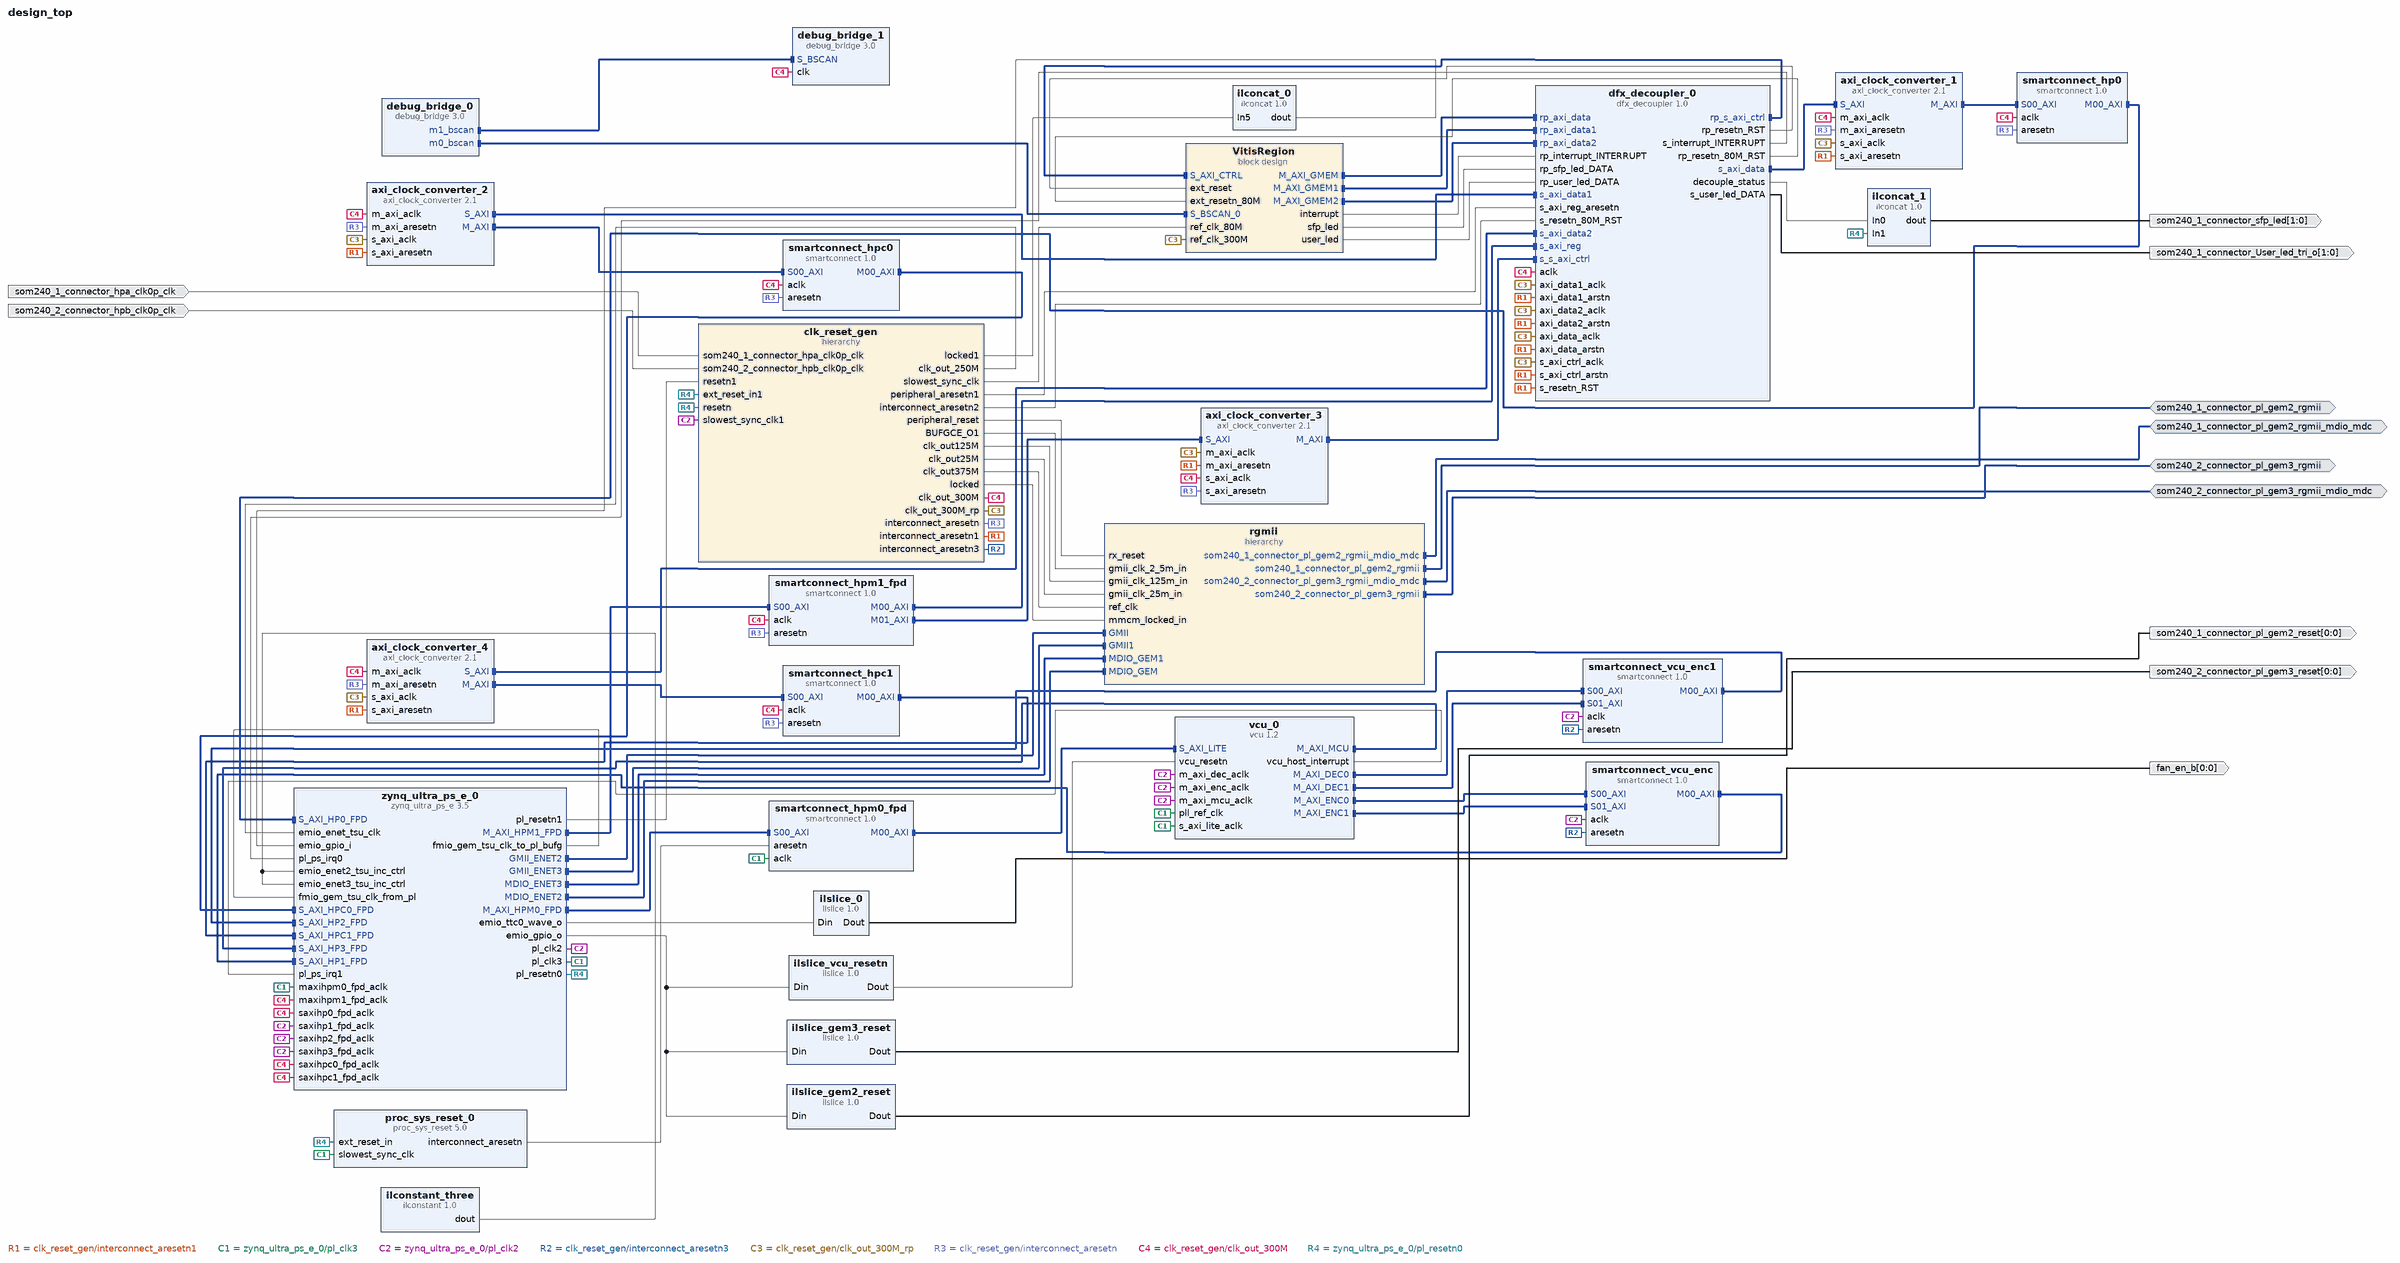
[diagram p0: block diagram of the top level]
# Vivado block design design_top, xck26-sfvc784-2LV-c, Vivado 2025.2
create_bd_design design_top

create_bd_intf_port -mode Master -vlnv xilinx.com:interface:mdio_rtl:1.0 som240_1_connector_pl_gem2_rgmii_mdio_mdc
create_bd_intf_port -mode Master -vlnv xilinx.com:interface:rgmii_rtl:1.0 som240_1_connector_pl_gem2_rgmii
create_bd_intf_port -mode Master -vlnv xilinx.com:interface:mdio_rtl:1.0 som240_2_connector_pl_gem3_rgmii_mdio_mdc
create_bd_intf_port -mode Master -vlnv xilinx.com:interface:rgmii_rtl:1.0 som240_2_connector_pl_gem3_rgmii
create_bd_port -dir I -type clk som240_2_connector_hpb_clk0p_clk
set_property -dict {CONFIG.FREQ_HZ 25000000 CONFIG.PHASE 0.0} [get_bd_ports som240_2_connector_hpb_clk0p_clk]
create_bd_port -dir I -type clk som240_1_connector_hpa_clk0p_clk
set_property -dict {CONFIG.FREQ_HZ 25000000 CONFIG.PHASE 0.0} [get_bd_ports som240_1_connector_hpa_clk0p_clk]
create_bd_port -dir O -from 0 -to 0 fan_en_b
create_bd_port -dir O -from 0 -to 0 -type rst som240_1_connector_pl_gem2_reset
create_bd_port -dir O -from 0 -to 0 -type rst som240_2_connector_pl_gem3_reset
create_bd_port -dir O -from 1 -to 0 som240_1_connector_User_led_tri_o
create_bd_port -dir O -from 1 -to 0 -type data som240_1_connector_sfp_led

create_bd_cell -type inline_hdl -vlnv xilinx.com:inline_hdl:ilslice:1.0 ilslice_0
set_property -dict {CONFIG.DIN_FROM 2 CONFIG.DIN_TO 2 CONFIG.DIN_WIDTH 3} [get_bd_cells ilslice_0]
create_bd_cell -type hier rgmii
create_bd_cell -type ip -vlnv xilinx.com:ip:dfx_decoupler:1.0 dfx_decoupler_0
set_property -dict [list \
  CONFIG.ALL_PARAMS {['ALWAYS_HAVE_AXI_CLK 1', 'INTF {', 'axi_data {ID 0 VLNV xilinx.com:interface:aximm_rtl:1.0 PROTOCOL AXI4 SIGNALS {ARVALID {WIDTH 1 PRESENT 1} ARREADY {WIDTH 1 PRESENT 1} AWVALID {WIDTH 1 PRESENT 1} AWREADY {WIDTH 1 PRESENT 1} BVALID', '{WIDTH 1 PRESENT 1} BREADY {WIDTH 1 PRESENT 1} RVALID {WIDTH 1 PRESENT 1} RREADY {WIDTH 1 PRESENT 1} WVALID {WIDTH 1 PRESENT 1} WREADY {WIDTH 1 PRESENT 1} AWID {WIDTH 0 PRESENT 0} AWADDR {WIDTH 36', 'PRESENT 1} AWLEN {WIDTH 8 PRESENT 1} AWSIZE {WIDTH 3 PRESENT 1} AWBURST {WIDTH 2 PRESENT 0} AWLOCK {WIDTH 1 PRESENT 0} AWCACHE {WIDTH 4 PRESENT 1} AWPROT {WIDTH 3 PRESENT 1} AWREGION {WIDTH 4 PRESENT', '0} AWQOS {WIDTH 4 PRESENT 0} AWUSER {WIDTH 0 PRESENT 0} WID {WIDTH 0 PRESENT 0} WDATA {WIDTH 32 PRESENT 1} WSTRB {WIDTH 4 PRESENT 1} WLAST {WIDTH 1 PRESENT 1} WUSER {WIDTH 0 PRESENT 0} BID {WIDTH 0', 'PRESENT 0} BRESP {WIDTH 2 PRESENT 1} BUSER {WIDTH 0 PRESENT 0} ARID {WIDTH 0 PRESENT 0} ARADDR {WIDTH 36 PRESENT 1} ARLEN {WIDTH 8 PRESENT 1} ARSIZE {WIDTH 3 PRESENT 1} ARBURST {WIDTH 2 PRESENT 0}', 'ARLOCK {WIDTH 1 PRESENT 0} ARCACHE {WIDTH 4 PRESENT 1} ARPROT {WIDTH 3 PRESENT 1} ARREGION {WIDTH 4 PRESENT 0} ARQOS {WIDTH 4 PRESENT 0} ARUSER {WIDTH 0 PRESENT 0} RID {WIDTH 0 PRESENT 0} RDATA {WIDTH', '32 PRESENT 1} RRESP {WIDTH 2 PRESENT 0} RLAST {WIDTH 1 PRESENT 1} RUSER {WIDTH 0 PRESENT 0}}} resetn {ID 1 VLNV xilinx.com:signal:reset_rtl:1.0 MODE slave SIGNALS {RST {PRESENT 1 WIDTH 1}}} resetn_80M', '{ID 3 VLNV xilinx.com:signal:reset_rtl:1.0 MODE slave SIGNALS {RST {PRESENT 1 WIDTH 1}}} sfp_led {ID 4 VLNV xilinx.com:signal:data_rtl:1.0 SIGNALS {DATA {MANAGEMENT manual WIDTH 2}}} user_led {ID 5', 'MODE master VLNV xilinx.com:signal:data_rtl:1.0 SIGNALS {DATA {MANAGEMENT manual WIDTH 2}}} interrupt {ID 2 VLNV xilinx.com:signal:interrupt_rtl:1.0 SIGNALS {INTERRUPT {MANAGEMENT manual WIDTH 8}}}', 's_axi_ctrl {ID 6 VLNV xilinx.com:interface:aximm_rtl:1.0 PROTOCOL AXI4LITE SIGNALS {ARVALID {PRESENT 1 WIDTH 1} ARREADY {PRESENT 1 WIDTH 1} AWVALID {PRESENT 1 WIDTH 1} AWREADY {PRESENT 1 WIDTH 1}', 'BVALID {PRESENT 1 WIDTH 1} BREADY {PRESENT 1 WIDTH 1} RVALID {PRESENT 1 WIDTH 1} RREADY {PRESENT 1 WIDTH 1} WVALID {PRESENT 1 WIDTH 1} WREADY {PRESENT 1 WIDTH 1} AWADDR {PRESENT 1 WIDTH 32} AWLEN', '{PRESENT 0 WIDTH 8} AWSIZE {PRESENT 0 WIDTH 3} AWBURST {PRESENT 0 WIDTH 2} AWLOCK {PRESENT 0 WIDTH 1} AWCACHE {PRESENT 0 WIDTH 4} AWPROT {PRESENT 1 WIDTH 3} WDATA {PRESENT 1 WIDTH 32} WSTRB {PRESENT 1', 'WIDTH 4} WLAST {PRESENT 0 WIDTH 1} BRESP {PRESENT 1 WIDTH 2} ARADDR {PRESENT 1 WIDTH 32} ARLEN {PRESENT 0 WIDTH 8} ARSIZE {PRESENT 0 WIDTH 3} ARBURST {PRESENT 0 WIDTH 2} ARLOCK {PRESENT 0 WIDTH 1}', 'ARCACHE {PRESENT 0 WIDTH 4} ARPROT {PRESENT 1 WIDTH 3} RDATA {PRESENT 1 WIDTH 32} RRESP {PRESENT 1 WIDTH 2} RLAST {PRESENT 0 WIDTH 1} AWID {WIDTH 0 PRESENT 0} AWREGION {WIDTH 4 PRESENT 0} AWQOS {WIDTH', '4 PRESENT 0} AWUSER {WIDTH 0 PRESENT 0} WID {WIDTH 0 PRESENT 0} WUSER {WIDTH 0 PRESENT 0} BID {WIDTH 0 PRESENT 0} BUSER {WIDTH 0 PRESENT 0} ARID {WIDTH 0 PRESENT 0} ARREGION {WIDTH 4 PRESENT 0} ARQOS', '{WIDTH 4 PRESENT 0} ARUSER {WIDTH 0 PRESENT 0} RID {WIDTH 0 PRESENT 0} RUSER {WIDTH 0 PRESENT 0}} MODE slave} axi_data1 {ID 7 VLNV xilinx.com:interface:aximm_rtl:1.0 PROTOCOL AXI4 SIGNALS {ARVALID', '{WIDTH 1 PRESENT 1} ARREADY {WIDTH 1 PRESENT 1} AWVALID {WIDTH 1 PRESENT 1} AWREADY {WIDTH 1 PRESENT 1} BVALID {WIDTH 1 PRESENT 1} BREADY {WIDTH 1 PRESENT 1} RVALID {WIDTH 1 PRESENT 1} RREADY {WIDTH 1', 'PRESENT 1} WVALID {WIDTH 1 PRESENT 1} WREADY {WIDTH 1 PRESENT 1} AWID {WIDTH 0 PRESENT 0} AWADDR {WIDTH 36 PRESENT 1} AWLEN {WIDTH 8 PRESENT 1} AWSIZE {WIDTH 3 PRESENT 1} AWBURST {WIDTH 2 PRESENT 0}', 'AWLOCK {WIDTH 1 PRESENT 0} AWCACHE {WIDTH 4 PRESENT 1} AWPROT {WIDTH 3 PRESENT 1} AWREGION {WIDTH 4 PRESENT 0} AWQOS {WIDTH 4 PRESENT 0} AWUSER {WIDTH 0 PRESENT 0} WID {WIDTH 0 PRESENT 0} WDATA {WIDTH', '32 PRESENT 1} WSTRB {WIDTH 4 PRESENT 1} WLAST {WIDTH 1 PRESENT 1} WUSER {WIDTH 0 PRESENT 0} BID {WIDTH 0 PRESENT 0} BRESP {WIDTH 2 PRESENT 1} BUSER {WIDTH 0 PRESENT 0} ARID {WIDTH 0 PRESENT 0} ARADDR', '{WIDTH 36 PRESENT 1} ARLEN {WIDTH 8 PRESENT 1} ARSIZE {WIDTH 3 PRESENT 1} ARBURST {WIDTH 2 PRESENT 0} ARLOCK {WIDTH 1 PRESENT 0} ARCACHE {WIDTH 4 PRESENT 1} ARPROT {WIDTH 3 PRESENT 1} ARREGION {WIDTH', '4 PRESENT 0} ARQOS {WIDTH 4 PRESENT 0} ARUSER {WIDTH 0 PRESENT 0} RID {WIDTH 0 PRESENT 0} RDATA {WIDTH 32 PRESENT 1} RRESP {WIDTH 2 PRESENT 0} RLAST {WIDTH 1 PRESENT 1} RUSER {WIDTH 0 PRESENT 0}}}', 'axi_data2 {ID 8 VLNV xilinx.com:interface:aximm_rtl:1.0 PROTOCOL AXI4 SIGNALS {ARVALID {WIDTH 1 PRESENT 1} ARREADY {WIDTH 1 PRESENT 1} AWVALID {WIDTH 1 PRESENT 1} AWREADY {WIDTH 1 PRESENT 1} BVALID', '{WIDTH 1 PRESENT 1} BREADY {WIDTH 1 PRESENT 1} RVALID {WIDTH 1 PRESENT 1} RREADY {WIDTH 1 PRESENT 1} WVALID {WIDTH 1 PRESENT 1} WREADY {WIDTH 1 PRESENT 1} AWID {WIDTH 0 PRESENT 0} AWADDR {WIDTH 36', 'PRESENT 1} AWLEN {WIDTH 8 PRESENT 1} AWSIZE {WIDTH 3 PRESENT 1} AWBURST {WIDTH 2 PRESENT 0} AWLOCK {WIDTH 1 PRESENT 0} AWCACHE {WIDTH 4 PRESENT 1} AWPROT {WIDTH 3 PRESENT 1} AWREGION {WIDTH 4 PRESENT', '0} AWQOS {WIDTH 4 PRESENT 0} AWUSER {WIDTH 0 PRESENT 0} WID {WIDTH 0 PRESENT 0} WDATA {WIDTH 32 PRESENT 1} WSTRB {WIDTH 4 PRESENT 1} WLAST {WIDTH 1 PRESENT 1} WUSER {WIDTH 0 PRESENT 0} BID {WIDTH 0', 'PRESENT 0} BRESP {WIDTH 2 PRESENT 1} BUSER {WIDTH 0 PRESENT 0} ARID {WIDTH 0 PRESENT 0} ARADDR {WIDTH 36 PRESENT 1} ARLEN {WIDTH 8 PRESENT 1} ARSIZE {WIDTH 3 PRESENT 1} ARBURST {WIDTH 2 PRESENT 0}', 'ARLOCK {WIDTH 1 PRESENT 0} ARCACHE {WIDTH 4 PRESENT 1} ARPROT {WIDTH 3 PRESENT 1} ARREGION {WIDTH 4 PRESENT 0} ARQOS {WIDTH 4 PRESENT 0} ARUSER {WIDTH 0 PRESENT 0} RID {WIDTH 0 PRESENT 0} RDATA {WIDTH', '32 PRESENT 1} RRESP {WIDTH 2 PRESENT 0} RLAST {WIDTH 1 PRESENT 1} RUSER {WIDTH 0 PRESENT 0}}}', '}', 'HAS_AXI_LITE 1', 'HAS_SIGNAL_CONTROL 0']} \
  CONFIG.GUI_INTERFACE_NAME axi_data \
  CONFIG.GUI_INTERFACE_PROTOCOL axi4 \
  CONFIG.GUI_SELECT_CDC_STAGES 0 \
  CONFIG.GUI_SELECT_INTERFACE 0 \
  CONFIG.GUI_SELECT_MODE master \
  CONFIG.GUI_SELECT_VLNV xilinx.com:interface:aximm_rtl:1.0 \
  CONFIG.GUI_SIGNAL_MANAGEMENT_0 auto \
] [get_bd_cells dfx_decoupler_0]
create_bd_cell -type ip -vlnv xilinx.com:ip:axi_clock_converter:2.1 axi_clock_converter_1
create_bd_cell -type ip -vlnv xilinx.com:ip:zynq_ultra_ps_e:3.5 zynq_ultra_ps_e_0
set_property -dict [list \
  CONFIG.CAN0_BOARD_INTERFACE custom \
  CONFIG.CAN1_BOARD_INTERFACE custom \
  CONFIG.CSU_BOARD_INTERFACE custom \
  CONFIG.DP_BOARD_INTERFACE custom \
  CONFIG.GEM0_BOARD_INTERFACE custom \
  CONFIG.GEM1_BOARD_INTERFACE custom \
  CONFIG.GEM2_BOARD_INTERFACE custom \
  CONFIG.GEM3_BOARD_INTERFACE custom \
  CONFIG.GPIO_BOARD_INTERFACE custom \
  CONFIG.IIC0_BOARD_INTERFACE custom \
  CONFIG.IIC1_BOARD_INTERFACE custom \
  CONFIG.NAND_BOARD_INTERFACE custom \
  CONFIG.PCIE_BOARD_INTERFACE custom \
  CONFIG.PJTAG_BOARD_INTERFACE custom \
  CONFIG.PMU_BOARD_INTERFACE custom \
  CONFIG.PSU_BANK_0_IO_STANDARD LVCMOS18 \
  CONFIG.PSU_BANK_1_IO_STANDARD LVCMOS18 \
  CONFIG.PSU_BANK_2_IO_STANDARD LVCMOS18 \
  CONFIG.PSU_BANK_3_IO_STANDARD LVCMOS18 \
  CONFIG.PSU_USB3__DUAL_CLOCK_ENABLE 1 \
  CONFIG.PSU__CAN1__PERIPHERAL__ENABLE 0 \
  CONFIG.PSU__CRF_APB__ACPU_CTRL__FREQMHZ 1333.333 \
  CONFIG.PSU__CRF_APB__ACPU_CTRL__SRCSEL APLL \
  CONFIG.PSU__CRF_APB__APLL_CTRL__SRCSEL PSS_REF_CLK \
  CONFIG.PSU__CRF_APB__DBG_FPD_CTRL__FREQMHZ 250 \
  CONFIG.PSU__CRF_APB__DBG_FPD_CTRL__SRCSEL IOPLL \
  CONFIG.PSU__CRF_APB__DBG_TRACE_CTRL__FREQMHZ 250 \
  CONFIG.PSU__CRF_APB__DBG_TRACE_CTRL__SRCSEL IOPLL \
  CONFIG.PSU__CRF_APB__DBG_TSTMP_CTRL__FREQMHZ 250 \
  CONFIG.PSU__CRF_APB__DBG_TSTMP_CTRL__SRCSEL IOPLL \
  CONFIG.PSU__CRF_APB__DDR_CTRL__FREQMHZ 1200 \
  CONFIG.PSU__CRF_APB__DDR_CTRL__SRCSEL DPLL \
  CONFIG.PSU__CRF_APB__DPDMA_REF_CTRL__FREQMHZ 600 \
  CONFIG.PSU__CRF_APB__DPDMA_REF_CTRL__SRCSEL DPLL \
  CONFIG.PSU__CRF_APB__DPLL_CTRL__SRCSEL PSS_REF_CLK \
  CONFIG.PSU__CRF_APB__DP_AUDIO_REF_CTRL__SRCSEL VPLL \
  CONFIG.PSU__CRF_APB__DP_STC_REF_CTRL__SRCSEL RPLL \
  CONFIG.PSU__CRF_APB__DP_VIDEO_REF_CTRL__SRCSEL VPLL \
  CONFIG.PSU__CRF_APB__GDMA_REF_CTRL__FREQMHZ 600 \
  CONFIG.PSU__CRF_APB__GDMA_REF_CTRL__SRCSEL DPLL \
  CONFIG.PSU__CRF_APB__GPU_REF_CTRL__FREQMHZ 600 \
  CONFIG.PSU__CRF_APB__GPU_REF_CTRL__SRCSEL DPLL \
  CONFIG.PSU__CRF_APB__TOPSW_LSBUS_CTRL__FREQMHZ 100 \
  CONFIG.PSU__CRF_APB__TOPSW_LSBUS_CTRL__SRCSEL IOPLL \
  CONFIG.PSU__CRF_APB__TOPSW_MAIN_CTRL__FREQMHZ 533.333 \
  CONFIG.PSU__CRF_APB__TOPSW_MAIN_CTRL__SRCSEL VPLL \
  CONFIG.PSU__CRF_APB__VPLL_CTRL__SRCSEL PSS_REF_CLK \
  CONFIG.PSU__CRL_APB__ADMA_REF_CTRL__FREQMHZ 500 \
  CONFIG.PSU__CRL_APB__ADMA_REF_CTRL__SRCSEL IOPLL \
  CONFIG.PSU__CRL_APB__CAN1_REF_CTRL__FREQMHZ 100 \
  CONFIG.PSU__CRL_APB__CAN1_REF_CTRL__SRCSEL IOPLL \
  CONFIG.PSU__CRL_APB__CPU_R5_CTRL__FREQMHZ 533.33 \
  CONFIG.PSU__CRL_APB__CPU_R5_CTRL__SRCSEL RPLL \
  CONFIG.PSU__CRL_APB__DBG_LPD_CTRL__FREQMHZ 250 \
  CONFIG.PSU__CRL_APB__DBG_LPD_CTRL__SRCSEL IOPLL \
  CONFIG.PSU__CRL_APB__GEM3_REF_CTRL__FREQMHZ 125 \
  CONFIG.PSU__CRL_APB__GEM3_REF_CTRL__SRCSEL IOPLL \
  CONFIG.PSU__CRL_APB__I2C0_REF_CTRL__FREQMHZ 100 \
  CONFIG.PSU__CRL_APB__I2C0_REF_CTRL__SRCSEL IOPLL \
  CONFIG.PSU__CRL_APB__I2C1_REF_CTRL__FREQMHZ 100 \
  CONFIG.PSU__CRL_APB__I2C1_REF_CTRL__SRCSEL IOPLL \
  CONFIG.PSU__CRL_APB__IOPLL_CTRL__SRCSEL PSS_REF_CLK \
  CONFIG.PSU__CRL_APB__IOU_SWITCH_CTRL__FREQMHZ 250 \
  CONFIG.PSU__CRL_APB__IOU_SWITCH_CTRL__SRCSEL IOPLL \
  CONFIG.PSU__CRL_APB__LPD_LSBUS_CTRL__FREQMHZ 100 \
  CONFIG.PSU__CRL_APB__LPD_LSBUS_CTRL__SRCSEL IOPLL \
  CONFIG.PSU__CRL_APB__LPD_SWITCH_CTRL__FREQMHZ 500 \
  CONFIG.PSU__CRL_APB__LPD_SWITCH_CTRL__SRCSEL IOPLL \
  CONFIG.PSU__CRL_APB__PCAP_CTRL__FREQMHZ 200 \
  CONFIG.PSU__CRL_APB__PCAP_CTRL__SRCSEL DPLL \
  CONFIG.PSU__CRL_APB__PL0_REF_CTRL__FREQMHZ 100 \
  CONFIG.PSU__CRL_APB__PL0_REF_CTRL__SRCSEL IOPLL \
  CONFIG.PSU__CRL_APB__PL1_REF_CTRL__FREQMHZ 300 \
  CONFIG.PSU__CRL_APB__PL1_REF_CTRL__SRCSEL IOPLL \
  CONFIG.PSU__CRL_APB__PL2_REF_CTRL__FREQMHZ 250 \
  CONFIG.PSU__CRL_APB__PL2_REF_CTRL__SRCSEL IOPLL \
  CONFIG.PSU__CRL_APB__PL3_REF_CTRL__FREQMHZ 60 \
  CONFIG.PSU__CRL_APB__PL3_REF_CTRL__SRCSEL IOPLL \
  CONFIG.PSU__CRL_APB__QSPI_REF_CTRL__FREQMHZ 125 \
  CONFIG.PSU__CRL_APB__QSPI_REF_CTRL__SRCSEL IOPLL \
  CONFIG.PSU__CRL_APB__RPLL_CTRL__SRCSEL PSS_REF_CLK \
  CONFIG.PSU__CRL_APB__SDIO1_REF_CTRL__FREQMHZ 200 \
  CONFIG.PSU__CRL_APB__SDIO1_REF_CTRL__SRCSEL RPLL \
  CONFIG.PSU__CRL_APB__SPI1_REF_CTRL__SRCSEL DPLL \
  CONFIG.PSU__CRL_APB__TIMESTAMP_REF_CTRL__FREQMHZ 100 \
  CONFIG.PSU__CRL_APB__TIMESTAMP_REF_CTRL__SRCSEL IOPLL \
  CONFIG.PSU__CRL_APB__UART0_REF_CTRL__FREQMHZ 100 \
  CONFIG.PSU__CRL_APB__UART0_REF_CTRL__SRCSEL IOPLL \
  CONFIG.PSU__CRL_APB__UART1_REF_CTRL__FREQMHZ 100 \
  CONFIG.PSU__CRL_APB__UART1_REF_CTRL__SRCSEL IOPLL \
  CONFIG.PSU__CRL_APB__USB0_BUS_REF_CTRL__FREQMHZ 250 \
  CONFIG.PSU__CRL_APB__USB0_BUS_REF_CTRL__SRCSEL IOPLL \
  CONFIG.PSU__CRL_APB__USB3_DUAL_REF_CTRL__FREQMHZ 20 \
  CONFIG.PSU__CRL_APB__USB3_DUAL_REF_CTRL__SRCSEL IOPLL \
  CONFIG.PSU__CRL_APB__USB3__ENABLE 1 \
  CONFIG.PSU__CSUPMU__PERIPHERAL__VALID 1 \
  CONFIG.PSU__DDRC__BUS_WIDTH {64 Bit} \
  CONFIG.PSU__DDRC__COMPONENTS Components \
  CONFIG.PSU__DDRC__DEVICE_CAPACITY {8192 MBits} \
  CONFIG.PSU__DDRC__DRAM_WIDTH {16 Bits} \
  CONFIG.PSU__DDRC__ECC Disabled \
  CONFIG.PSU__DDRC__MEMORY_TYPE {DDR 4} \
  CONFIG.PSU__DDRC__SPEED_BIN DDR4_2400R \
  CONFIG.PSU__DDR_HIGH_ADDRESS_GUI_ENABLE 1 \
  CONFIG.PSU__DDR__INTERFACE__FREQMHZ 600.000 \
  CONFIG.PSU__DEVICE_TYPE EV \
  CONFIG.PSU__DISPLAYPORT__PERIPHERAL__ENABLE 0 \
  CONFIG.PSU__DLL__ISUSED 0 \
  CONFIG.PSU__ENET0__PERIPHERAL__ENABLE 1 \
  CONFIG.PSU__ENET0__PERIPHERAL__IO {GT Lane0} \
  CONFIG.PSU__ENET1__GRP_MDIO__ENABLE 1 \
  CONFIG.PSU__ENET1__GRP_MDIO__IO {MIO 50 .. 51} \
  CONFIG.PSU__ENET1__PERIPHERAL__ENABLE 1 \
  CONFIG.PSU__ENET1__PERIPHERAL__IO {MIO 38 .. 49} \
  CONFIG.PSU__ENET2__GRP_MDIO__ENABLE 1 \
  CONFIG.PSU__ENET2__GRP_MDIO__IO EMIO \
  CONFIG.PSU__ENET2__PERIPHERAL__ENABLE 1 \
  CONFIG.PSU__ENET2__PERIPHERAL__IO EMIO \
  CONFIG.PSU__ENET3__FIFO__ENABLE 0 \
  CONFIG.PSU__ENET3__GRP_MDIO__ENABLE 1 \
  CONFIG.PSU__ENET3__GRP_MDIO__IO EMIO \
  CONFIG.PSU__ENET3__PERIPHERAL__ENABLE 1 \
  CONFIG.PSU__ENET3__PERIPHERAL__IO EMIO \
  CONFIG.PSU__ENET3__PTP__ENABLE 0 \
  CONFIG.PSU__FPGA_PL0_ENABLE 1 \
  CONFIG.PSU__FPGA_PL1_ENABLE 1 \
  CONFIG.PSU__FPGA_PL2_ENABLE 1 \
  CONFIG.PSU__FPGA_PL3_ENABLE 1 \
  CONFIG.PSU__GEM0__REF_CLK_FREQ 125 \
  CONFIG.PSU__GEM0__REF_CLK_SEL {Ref Clk0} \
  CONFIG.PSU__GEM3_COHERENCY 0 \
  CONFIG.PSU__GEM3_ROUTE_THROUGH_FPD 0 \
  CONFIG.PSU__GEM__TSU__ENABLE 1 \
  CONFIG.PSU__GEM__TSU__IO EMIO \
  CONFIG.PSU__GPIO0_MIO__IO {MIO 0 .. 25} \
  CONFIG.PSU__GPIO0_MIO__PERIPHERAL__ENABLE 1 \
  CONFIG.PSU__GPIO1_MIO__IO {MIO 26 .. 51} \
  CONFIG.PSU__GPIO1_MIO__PERIPHERAL__ENABLE 1 \
  CONFIG.PSU__GPIO_EMIO_WIDTH 6 \
  CONFIG.PSU__GPIO_EMIO__PERIPHERAL__ENABLE 1 \
  CONFIG.PSU__GPIO_EMIO__PERIPHERAL__IO 6 \
  CONFIG.PSU__GPIO_EMIO__WIDTH {[93:0]} \
  CONFIG.PSU__I2C0__PERIPHERAL__ENABLE 0 \
  CONFIG.PSU__I2C1__PERIPHERAL__ENABLE 1 \
  CONFIG.PSU__I2C1__PERIPHERAL__IO {MIO 24 .. 25} \
  CONFIG.PSU__IOU_SLCR__IOU_TTC_APB_CLK__TTC0_SEL APB \
  CONFIG.PSU__IOU_SLCR__IOU_TTC_APB_CLK__TTC1_SEL APB \
  CONFIG.PSU__IOU_SLCR__IOU_TTC_APB_CLK__TTC2_SEL APB \
  CONFIG.PSU__IOU_SLCR__IOU_TTC_APB_CLK__TTC3_SEL APB \
  CONFIG.PSU__IRQ_P2F_USB2_OTG__INT0 0 \
  CONFIG.PSU__IRQ_P2F_USB2_OTG__INT1 0 \
  CONFIG.PSU__MAXIGP0__DATA_WIDTH 128 \
  CONFIG.PSU__NUM_FABRIC_RESETS 2 \
  CONFIG.PSU__OVERRIDE_HPX_QOS 0 \
  CONFIG.PSU__OVERRIDE__BASIC_CLOCK 0 \
  CONFIG.PSU__PMU_COHERENCY 0 \
  CONFIG.PSU__PMU__AIBACK__ENABLE 0 \
  CONFIG.PSU__PMU__EMIO_GPI__ENABLE 0 \
  CONFIG.PSU__PMU__EMIO_GPO__ENABLE 0 \
  CONFIG.PSU__PMU__GPI0__ENABLE 1 \
  CONFIG.PSU__PMU__GPI0__IO {MIO 26} \
  CONFIG.PSU__PMU__GPI1__ENABLE 0 \
  CONFIG.PSU__PMU__GPI2__ENABLE 0 \
  CONFIG.PSU__PMU__GPI3__ENABLE 0 \
  CONFIG.PSU__PMU__GPI4__ENABLE 0 \
  CONFIG.PSU__PMU__GPI5__ENABLE 1 \
  CONFIG.PSU__PMU__GPI5__IO {MIO 31} \
  CONFIG.PSU__PMU__GPO0__ENABLE 0 \
  CONFIG.PSU__PMU__GPO1__ENABLE 0 \
  CONFIG.PSU__PMU__GPO2__ENABLE 0 \
  CONFIG.PSU__PMU__GPO3__ENABLE 1 \
  CONFIG.PSU__PMU__GPO3__IO {MIO 35} \
  CONFIG.PSU__PMU__GPO3__POLARITY low \
  CONFIG.PSU__PMU__GPO4__ENABLE 0 \
  CONFIG.PSU__PMU__GPO5__ENABLE 0 \
  CONFIG.PSU__PMU__PERIPHERAL__ENABLE 1 \
  CONFIG.PSU__PMU__PLERROR__ENABLE 0 \
  CONFIG.PSU__PRESET_APPLIED 1 \
  CONFIG.PSU__PSS_REF_CLK__FREQMHZ 33.333 \
  CONFIG.PSU__QSPI_COHERENCY 0 \
  CONFIG.PSU__QSPI_ROUTE_THROUGH_FPD 0 \
  CONFIG.PSU__QSPI__GRP_FBCLK__ENABLE 0 \
  CONFIG.PSU__QSPI__PERIPHERAL__DATA_MODE x4 \
  CONFIG.PSU__QSPI__PERIPHERAL__ENABLE 1 \
  CONFIG.PSU__QSPI__PERIPHERAL__IO {MIO 0 .. 5} \
  CONFIG.PSU__QSPI__PERIPHERAL__MODE Single \
  CONFIG.PSU__SATA__PERIPHERAL__ENABLE 0 \
  CONFIG.PSU__SAXIGP5__DATA_WIDTH 32 \
  CONFIG.PSU__SD0__CLK_100_SDR_OTAP_DLY 0x00 \
  CONFIG.PSU__SD0__CLK_200_SDR_OTAP_DLY 0x00 \
  CONFIG.PSU__SD0__CLK_50_DDR_ITAP_DLY 0x00 \
  CONFIG.PSU__SD0__CLK_50_DDR_OTAP_DLY 0x00 \
  CONFIG.PSU__SD0__CLK_50_SDR_ITAP_DLY 0x00 \
  CONFIG.PSU__SD0__CLK_50_SDR_OTAP_DLY 0x00 \
  CONFIG.PSU__SD1__CLK_100_SDR_OTAP_DLY 0x00 \
  CONFIG.PSU__SD1__CLK_200_SDR_OTAP_DLY 0x00 \
  CONFIG.PSU__SD1__CLK_50_DDR_ITAP_DLY 0x00 \
  CONFIG.PSU__SD1__CLK_50_DDR_OTAP_DLY 0x00 \
  CONFIG.PSU__SD1__CLK_50_SDR_ITAP_DLY 0x00 \
  CONFIG.PSU__SD1__CLK_50_SDR_OTAP_DLY 0x00 \
  CONFIG.PSU__SD1__PERIPHERAL__ENABLE 0 \
  CONFIG.PSU__SPI1__GRP_SS0__IO {MIO 9} \
  CONFIG.PSU__SPI1__PERIPHERAL__ENABLE 1 \
  CONFIG.PSU__SPI1__PERIPHERAL__IO {MIO 6 .. 11} \
  CONFIG.PSU__SWDT0__CLOCK__ENABLE 0 \
  CONFIG.PSU__SWDT0__PERIPHERAL__ENABLE 1 \
  CONFIG.PSU__SWDT0__RESET__ENABLE 0 \
  CONFIG.PSU__SWDT1__CLOCK__ENABLE 0 \
  CONFIG.PSU__SWDT1__PERIPHERAL__ENABLE 1 \
  CONFIG.PSU__SWDT1__RESET__ENABLE 0 \
  CONFIG.PSU__TSU__BUFG_PORT_PAIR 0 \
  CONFIG.PSU__TTC0__CLOCK__ENABLE 0 \
  CONFIG.PSU__TTC0__PERIPHERAL__ENABLE 1 \
  CONFIG.PSU__TTC0__WAVEOUT__ENABLE 1 \
  CONFIG.PSU__TTC0__WAVEOUT__IO EMIO \
  CONFIG.PSU__TTC1__CLOCK__ENABLE 0 \
  CONFIG.PSU__TTC1__PERIPHERAL__ENABLE 1 \
  CONFIG.PSU__TTC1__WAVEOUT__ENABLE 0 \
  CONFIG.PSU__TTC2__CLOCK__ENABLE 0 \
  CONFIG.PSU__TTC2__PERIPHERAL__ENABLE 1 \
  CONFIG.PSU__TTC2__WAVEOUT__ENABLE 0 \
  CONFIG.PSU__TTC3__CLOCK__ENABLE 0 \
  CONFIG.PSU__TTC3__PERIPHERAL__ENABLE 1 \
  CONFIG.PSU__TTC3__WAVEOUT__ENABLE 0 \
  CONFIG.PSU__UART0__PERIPHERAL__ENABLE 0 \
  CONFIG.PSU__UART1__BAUD_RATE 115200 \
  CONFIG.PSU__UART1__MODEM__ENABLE 0 \
  CONFIG.PSU__UART1__PERIPHERAL__ENABLE 1 \
  CONFIG.PSU__UART1__PERIPHERAL__IO {MIO 36 .. 37} \
  CONFIG.PSU__USB0_COHERENCY 0 \
  CONFIG.PSU__USB0__PERIPHERAL__ENABLE 1 \
  CONFIG.PSU__USB0__PERIPHERAL__IO {MIO 52 .. 63} \
  CONFIG.PSU__USB0__REF_CLK_FREQ 26 \
  CONFIG.PSU__USB0__REF_CLK_SEL {Ref Clk2} \
  CONFIG.PSU__USB0__RESET__ENABLE 1 \
  CONFIG.PSU__USB0__RESET__IO {MIO 76} \
  CONFIG.PSU__USB1__PERIPHERAL__ENABLE 1 \
  CONFIG.PSU__USB1__PERIPHERAL__IO {MIO 64 .. 75} \
  CONFIG.PSU__USB1__REF_CLK_FREQ 26 \
  CONFIG.PSU__USB1__REF_CLK_SEL {Ref Clk3} \
  CONFIG.PSU__USB1__RESET__ENABLE 1 \
  CONFIG.PSU__USB1__RESET__IO {MIO 77} \
  CONFIG.PSU__USB2_0__EMIO__ENABLE 0 \
  CONFIG.PSU__USB3_0__EMIO__ENABLE 0 \
  CONFIG.PSU__USB3_0__PERIPHERAL__ENABLE 1 \
  CONFIG.PSU__USB3_0__PERIPHERAL__IO {GT Lane2} \
  CONFIG.PSU__USB3_1__PERIPHERAL__ENABLE 1 \
  CONFIG.PSU__USB3_1__PERIPHERAL__IO {GT Lane3} \
  CONFIG.PSU__USB__RESET__MODE {Separate MIO Pin} \
  CONFIG.PSU__USB__RESET__POLARITY {Active Low} \
  CONFIG.PSU__USE__IRQ0 1 \
  CONFIG.PSU__USE__IRQ1 1 \
  CONFIG.PSU__USE__M_AXI_GP0 1 \
  CONFIG.PSU__USE__M_AXI_GP1 1 \
  CONFIG.PSU__USE__M_AXI_GP2 0 \
  CONFIG.PSU__USE__S_AXI_GP0 1 \
  CONFIG.PSU__USE__S_AXI_GP1 1 \
  CONFIG.PSU__USE__S_AXI_GP2 1 \
  CONFIG.PSU__USE__S_AXI_GP3 1 \
  CONFIG.PSU__USE__S_AXI_GP4 1 \
  CONFIG.PSU__USE__S_AXI_GP5 1 \
  CONFIG.QSPI_BOARD_INTERFACE custom \
  CONFIG.SATA_BOARD_INTERFACE custom \
  CONFIG.SD0_BOARD_INTERFACE custom \
  CONFIG.SD1_BOARD_INTERFACE custom \
  CONFIG.SPI0_BOARD_INTERFACE custom \
  CONFIG.SPI1_BOARD_INTERFACE custom \
  CONFIG.SUBPRESET1 Custom \
  CONFIG.SUBPRESET2 Custom \
  CONFIG.SWDT0_BOARD_INTERFACE custom \
  CONFIG.SWDT1_BOARD_INTERFACE custom \
  CONFIG.TRACE_BOARD_INTERFACE custom \
  CONFIG.TTC0_BOARD_INTERFACE custom \
  CONFIG.TTC1_BOARD_INTERFACE custom \
  CONFIG.TTC2_BOARD_INTERFACE custom \
  CONFIG.TTC3_BOARD_INTERFACE custom \
  CONFIG.UART0_BOARD_INTERFACE custom \
  CONFIG.UART1_BOARD_INTERFACE custom \
  CONFIG.USB0_BOARD_INTERFACE custom \
  CONFIG.USB1_BOARD_INTERFACE custom \
  CONFIG.preset None \
] [get_bd_cells zynq_ultra_ps_e_0]
# 762 more settings of zynq_ultra_ps_e_0 are not shown: defaults, MIO pin electricals, DDR timing, and values the tool derives
create_bd_cell -type inline_hdl -vlnv xilinx.com:inline_hdl:ilconstant:1.0 ilconstant_three
set_property -dict {CONFIG.CONST_VAL 0b11 CONFIG.CONST_WIDTH 2} [get_bd_cells ilconstant_three]
create_bd_cell -type inline_hdl -vlnv xilinx.com:inline_hdl:ilslice:1.0 ilslice_gem2_reset
set_property -dict {CONFIG.DIN_WIDTH 6} [get_bd_cells ilslice_gem2_reset]
create_bd_cell -type inline_hdl -vlnv xilinx.com:inline_hdl:ilslice:1.0 ilslice_gem3_reset
set_property -dict {CONFIG.DIN_FROM 1 CONFIG.DIN_TO 1 CONFIG.DIN_WIDTH 6} [get_bd_cells ilslice_gem3_reset]
create_bd_cell -type inline_hdl -vlnv xilinx.com:inline_hdl:ilconcat:1.0 ilconcat_0
set_property -dict {CONFIG.NUM_PORTS 6} [get_bd_cells ilconcat_0]
create_bd_cell -type ip -vlnv xilinx.com:ip:smartconnect:1.0 smartconnect_hp0
set_property -dict {CONFIG.NUM_SI 1} [get_bd_cells smartconnect_hp0]
create_bd_cell -type ip -vlnv xilinx.com:ip:axi_clock_converter:2.1 axi_clock_converter_3
set_property -dict {CONFIG.SYNCHRONIZATION_STAGES 2} [get_bd_cells axi_clock_converter_3]
create_bd_cell -type ip -vlnv xilinx.com:ip:vcu:1.2 vcu_0
set_property -dict {CONFIG.CORE_CLK 667 CONFIG.ENC_VIDEO_STANDARD 0} [get_bd_cells vcu_0]
create_bd_cell -type ip -vlnv xilinx.com:ip:smartconnect:1.0 smartconnect_vcu_enc
create_bd_cell -type ip -vlnv xilinx.com:ip:smartconnect:1.0 smartconnect_vcu_enc1
create_bd_cell -type inline_hdl -vlnv xilinx.com:inline_hdl:ilslice:1.0 ilslice_vcu_resetn
set_property -dict {CONFIG.DIN_FROM 4 CONFIG.DIN_TO 4 CONFIG.DIN_WIDTH 6} [get_bd_cells ilslice_vcu_resetn]
create_bd_cell -type hier clk_reset_gen
create_bd_cell -type ip -vlnv xilinx.com:ip:debug_bridge:3.0 debug_bridge_0
set_property -dict {CONFIG.C_DEBUG_MODE 7 CONFIG.C_DESIGN_TYPE 0 CONFIG.C_NUM_BS_MASTER 2} [get_bd_cells debug_bridge_0]
create_bd_cell -type ip -vlnv xilinx.com:ip:debug_bridge:3.0 debug_bridge_1
create_bd_cell -type inline_hdl -vlnv xilinx.com:inline_hdl:ilconcat:1.0 ilconcat_1
create_bd_cell -type ip -vlnv xilinx.com:ip:smartconnect:1.0 smartconnect_hpm0_fpd
set_property -dict {CONFIG.NUM_SI 1} [get_bd_cells smartconnect_hpm0_fpd]
create_bd_cell -type ip -vlnv xilinx.com:ip:proc_sys_reset:5.0 proc_sys_reset_0
create_bd_cell -type ip -vlnv xilinx.com:ip:smartconnect:1.0 smartconnect_hpm1_fpd
set_property -dict {CONFIG.NUM_MI 2 CONFIG.NUM_SI 1} [get_bd_cells smartconnect_hpm1_fpd]
create_bd_cell -type ip -vlnv xilinx.com:ip:axi_clock_converter:2.1 axi_clock_converter_2
create_bd_cell -type ip -vlnv xilinx.com:ip:axi_clock_converter:2.1 axi_clock_converter_4
create_bd_cell -type ip -vlnv xilinx.com:ip:smartconnect:1.0 smartconnect_hpc1
set_property -dict {CONFIG.NUM_SI 1} [get_bd_cells smartconnect_hpc1]
create_bd_cell -type ip -vlnv xilinx.com:ip:smartconnect:1.0 smartconnect_hpc0
set_property -dict {CONFIG.NUM_SI 1} [get_bd_cells smartconnect_hpc0]
create_bd_cell -type container -reference VitisRegion VitisRegion
set_property -dict [list \
  CONFIG.ACTIVE_SIM_BD VitisRegion.bd \
  CONFIG.ACTIVE_SYNTH_BD VitisRegion.bd \
  CONFIG.ENABLE_DFX true \
  CONFIG.LIST_SIM_BD VitisRegion.bd \
  CONFIG.LIST_SYNTH_BD VitisRegion.bd \
  CONFIG.LOCK_PROPAGATE true \
] [get_bd_cells VitisRegion]

# ---- hierarchy /rgmii ----
current_bd_instance /rgmii
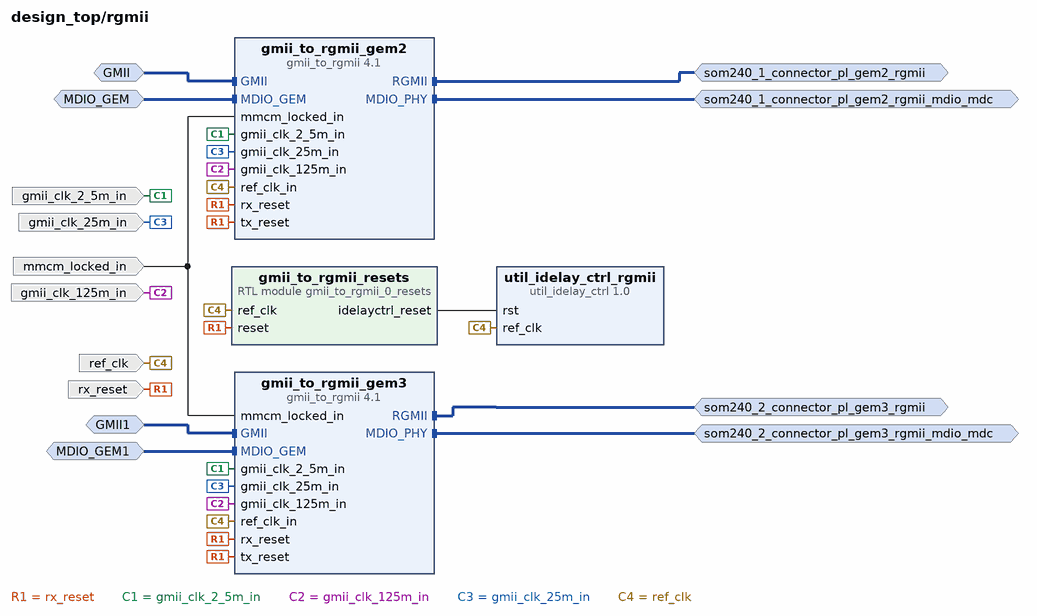
[diagram p1: block diagram inside /rgmii]
create_bd_intf_pin -mode Slave -vlnv xilinx.com:interface:mdio_rtl:1.0 MDIO_GEM
create_bd_intf_pin -mode Master -vlnv xilinx.com:interface:mdio_rtl:1.0 som240_1_connector_pl_gem2_rgmii_mdio_mdc
create_bd_intf_pin -mode Slave -vlnv xilinx.com:interface:gmii_rtl:1.0 GMII
create_bd_intf_pin -mode Master -vlnv xilinx.com:interface:rgmii_rtl:1.0 som240_1_connector_pl_gem2_rgmii
create_bd_intf_pin -mode Slave -vlnv xilinx.com:interface:mdio_rtl:1.0 MDIO_GEM1
create_bd_intf_pin -mode Master -vlnv xilinx.com:interface:mdio_rtl:1.0 som240_2_connector_pl_gem3_rgmii_mdio_mdc
create_bd_intf_pin -mode Slave -vlnv xilinx.com:interface:gmii_rtl:1.0 GMII1
create_bd_intf_pin -mode Master -vlnv xilinx.com:interface:rgmii_rtl:1.0 som240_2_connector_pl_gem3_rgmii
create_bd_pin -dir I -type rst rx_reset
create_bd_pin -dir I mmcm_locked_in
create_bd_pin -dir I -type clk ref_clk
create_bd_pin -dir I -type clk gmii_clk_125m_in
create_bd_pin -dir I -type clk gmii_clk_25m_in
create_bd_pin -dir I -type clk gmii_clk_2_5m_in

create_bd_cell -type ip -vlnv xilinx.com:ip:gmii_to_rgmii:4.1 gmii_to_rgmii_gem2
set_property -dict {CONFIG.C_PHYADDR 22} [get_bd_cells gmii_to_rgmii_gem2]
create_bd_cell -type ip -vlnv xilinx.com:ip:gmii_to_rgmii:4.1 gmii_to_rgmii_gem3
set_property -dict {CONFIG.C_PHYADDR 23} [get_bd_cells gmii_to_rgmii_gem3]
create_bd_cell -type module -reference gmii_to_rgmii_0_resets gmii_to_rgmii_resets
create_bd_cell -type ip -vlnv xilinx.com:ip:util_idelay_ctrl:1.0 util_idelay_ctrl_rgmii

# ---- hierarchy /clk_reset_gen ----
current_bd_instance /clk_reset_gen
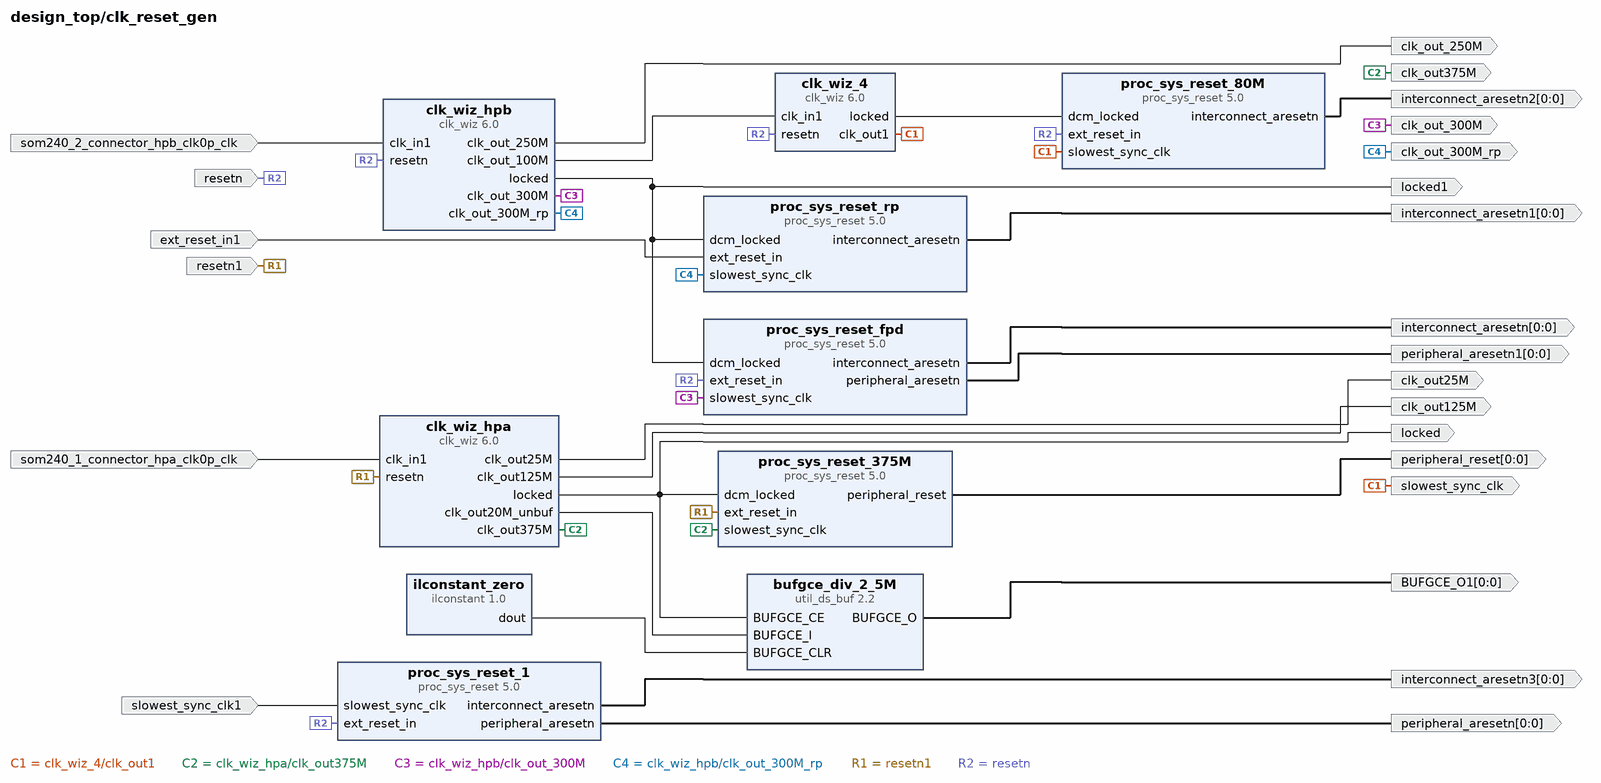
[diagram p2: block diagram inside /clk_reset_gen]
create_bd_pin -dir I -type rst resetn
create_bd_pin -dir O -from 0 -to 0 -type rst interconnect_aresetn
create_bd_pin -dir O -type clk slowest_sync_clk
create_bd_pin -dir O locked
create_bd_pin -dir O -from 0 -to 0 -type clk BUFGCE_O1
create_bd_pin -dir O -type clk clk_out375M
create_bd_pin -dir I -type rst resetn1
create_bd_pin -dir O -from 0 -to 0 -type rst peripheral_reset
create_bd_pin -dir O -from 0 -to 0 -type rst interconnect_aresetn1
create_bd_pin -dir O -from 0 -to 0 -type rst interconnect_aresetn2
create_bd_pin -dir I -type clk som240_1_connector_hpa_clk0p_clk
create_bd_pin -dir O -type clk clk_out25M
create_bd_pin -dir O -type clk clk_out125M
create_bd_pin -dir I -type clk som240_2_connector_hpb_clk0p_clk
create_bd_pin -dir O -type clk clk_out_250M
create_bd_pin -dir I -type clk slowest_sync_clk1
create_bd_pin -dir O -from 0 -to 0 -type rst interconnect_aresetn3
create_bd_pin -dir O locked1
create_bd_pin -dir O -from 0 -to 0 -type rst peripheral_aresetn
create_bd_pin -dir I -type rst ext_reset_in1
create_bd_pin -dir O -from 0 -to 0 -type rst peripheral_aresetn1
create_bd_pin -dir O -type clk clk_out_300M
create_bd_pin -dir O -type clk clk_out_300M_rp

create_bd_cell -type ip -vlnv xilinx.com:ip:proc_sys_reset:5.0 proc_sys_reset_fpd
create_bd_cell -type inline_hdl -vlnv xilinx.com:inline_hdl:ilconstant:1.0 ilconstant_zero
create_bd_cell -type ip -vlnv xilinx.com:ip:clk_wiz:6.0 clk_wiz_4
set_property -dict [list \
  CONFIG.CLKIN1_JITTER_PS 100.0 \
  CONFIG.CLKOUT1_DRIVES No_buffer \
  CONFIG.CLKOUT1_JITTER 151.652 \
  CONFIG.CLKOUT1_MATCHED_ROUTING false \
  CONFIG.CLKOUT1_PHASE_ERROR 114.212 \
  CONFIG.CLKOUT1_REQUESTED_OUT_FREQ 80 \
  CONFIG.CLKOUT1_USED true \
  CONFIG.CLKOUT2_DRIVES Buffer \
  CONFIG.CLKOUT2_JITTER 72.682 \
  CONFIG.CLKOUT2_MATCHED_ROUTING false \
  CONFIG.CLKOUT2_PHASE_ERROR 79.592 \
  CONFIG.CLKOUT2_REQUESTED_OUT_FREQ 100.000 \
  CONFIG.CLKOUT2_USED false \
  CONFIG.CLKOUT3_DRIVES Buffer \
  CONFIG.CLKOUT4_DRIVES Buffer \
  CONFIG.CLKOUT5_DRIVES Buffer \
  CONFIG.CLKOUT6_DRIVES Buffer \
  CONFIG.CLKOUT7_DRIVES Buffer \
  CONFIG.FEEDBACK_SOURCE FDBK_ONCHIP \
  CONFIG.MMCM_BANDWIDTH OPTIMIZED \
  CONFIG.MMCM_CLKFBOUT_MULT_F 8 \
  CONFIG.MMCM_CLKIN1_PERIOD 10.000 \
  CONFIG.MMCM_CLKIN2_PERIOD 10.000 \
  CONFIG.MMCM_CLKOUT0_DIVIDE_F 10 \
  CONFIG.MMCM_CLKOUT1_DIVIDE 1 \
  CONFIG.MMCM_COMPENSATION AUTO \
  CONFIG.MMCM_DIVCLK_DIVIDE 1 \
  CONFIG.NUM_OUT_CLKS 1 \
  CONFIG.OPTIMIZE_CLOCKING_STRUCTURE_EN true \
  CONFIG.PLL_CLKIN_PERIOD 10.000 \
  CONFIG.PRIMITIVE PLL \
  CONFIG.PRIM_SOURCE Global_buffer \
  CONFIG.RESET_PORT resetn \
  CONFIG.RESET_TYPE ACTIVE_LOW \
] [get_bd_cells clk_wiz_4]
create_bd_cell -type ip -vlnv xilinx.com:ip:util_ds_buf:2.2 bufgce_div_2_5M
set_property -dict {CONFIG.C_BUFGCE_DIV 8 CONFIG.C_BUF_TYPE BUFGCE_DIV} [get_bd_cells bufgce_div_2_5M]
create_bd_cell -type ip -vlnv xilinx.com:ip:proc_sys_reset:5.0 proc_sys_reset_375M
create_bd_cell -type ip -vlnv xilinx.com:ip:proc_sys_reset:5.0 proc_sys_reset_rp
create_bd_cell -type ip -vlnv xilinx.com:ip:proc_sys_reset:5.0 proc_sys_reset_80M
create_bd_cell -type ip -vlnv xilinx.com:ip:clk_wiz:6.0 clk_wiz_hpa
set_property -dict [list \
  CONFIG.CLKIN1_JITTER_PS 400.0 \
  CONFIG.CLKOUT1_DRIVES No_buffer \
  CONFIG.CLKOUT1_JITTER 183.353 \
  CONFIG.CLKOUT1_PHASE_ERROR 222.521 \
  CONFIG.CLKOUT1_REQUESTED_OUT_FREQ 20.000 \
  CONFIG.CLKOUT2_JITTER 178.591 \
  CONFIG.CLKOUT2_PHASE_ERROR 222.521 \
  CONFIG.CLKOUT2_REQUESTED_OUT_FREQ 25.0000 \
  CONFIG.CLKOUT2_USED true \
  CONFIG.CLKOUT3_JITTER 148.988 \
  CONFIG.CLKOUT3_PHASE_ERROR 222.521 \
  CONFIG.CLKOUT3_REQUESTED_OUT_FREQ 125.000 \
  CONFIG.CLKOUT3_USED true \
  CONFIG.CLKOUT4_JITTER 132.992 \
  CONFIG.CLKOUT4_PHASE_ERROR 222.521 \
  CONFIG.CLKOUT4_REQUESTED_OUT_FREQ 375.000 \
  CONFIG.CLKOUT4_USED true \
  CONFIG.CLKOUT5_JITTER 164.861 \
  CONFIG.CLKOUT5_PHASE_ERROR 222.521 \
  CONFIG.CLKOUT5_REQUESTED_OUT_FREQ 50.000 \
  CONFIG.CLKOUT5_USED true \
  CONFIG.CLKOUT6_JITTER 138.537 \
  CONFIG.CLKOUT6_PHASE_ERROR 222.521 \
  CONFIG.CLKOUT6_REQUESTED_OUT_FREQ 250.000 \
  CONFIG.CLKOUT6_USED true \
  CONFIG.CLK_IN1_BOARD_INTERFACE som240_1_connector_hpa_clk0p_clk \
  CONFIG.CLK_OUT1_PORT clk_out20M_unbuf \
  CONFIG.CLK_OUT2_PORT clk_out25M \
  CONFIG.CLK_OUT3_PORT clk_out125M \
  CONFIG.CLK_OUT4_PORT clk_out375M \
  CONFIG.CLK_OUT5_PORT clk_out50M \
  CONFIG.CLK_OUT6_PORT clk_out250M \
  CONFIG.FEEDBACK_SOURCE FDBK_ONCHIP \
  CONFIG.MMCM_CLKFBOUT_MULT_F 60.000 \
  CONFIG.MMCM_CLKIN1_PERIOD 40.000 \
  CONFIG.MMCM_CLKIN2_PERIOD 10.0 \
  CONFIG.MMCM_CLKOUT0_DIVIDE_F 75.000 \
  CONFIG.MMCM_CLKOUT1_DIVIDE 60 \
  CONFIG.MMCM_CLKOUT2_DIVIDE 12 \
  CONFIG.MMCM_CLKOUT3_DIVIDE 4 \
  CONFIG.MMCM_CLKOUT4_DIVIDE 30 \
  CONFIG.MMCM_CLKOUT5_DIVIDE 6 \
  CONFIG.NUM_OUT_CLKS 6 \
  CONFIG.OPTIMIZE_CLOCKING_STRUCTURE_EN true \
  CONFIG.RESET_PORT resetn \
  CONFIG.RESET_TYPE ACTIVE_LOW \
  CONFIG.USE_BOARD_FLOW true \
] [get_bd_cells clk_wiz_hpa]
create_bd_cell -type ip -vlnv xilinx.com:ip:clk_wiz:6.0 clk_wiz_hpb
set_property -dict [list \
  CONFIG.CLKIN1_JITTER_PS 400.0 \
  CONFIG.CLKIN2_JITTER_PS 400.0 \
  CONFIG.CLKOUT1_DRIVES Buffer \
  CONFIG.CLKOUT1_JITTER 138.537 \
  CONFIG.CLKOUT1_PHASE_ERROR 222.521 \
  CONFIG.CLKOUT1_REQUESTED_OUT_FREQ 250 \
  CONFIG.CLKOUT2_DRIVES Buffer \
  CONFIG.CLKOUT2_JITTER 152.629 \
  CONFIG.CLKOUT2_PHASE_ERROR 222.521 \
  CONFIG.CLKOUT2_REQUESTED_OUT_FREQ 100 \
  CONFIG.CLKOUT2_USED true \
  CONFIG.CLKOUT3_JITTER 148.988 \
  CONFIG.CLKOUT3_PHASE_ERROR 222.521 \
  CONFIG.CLKOUT3_REQUESTED_OUT_FREQ 125 \
  CONFIG.CLKOUT3_USED true \
  CONFIG.CLKOUT4_JITTER 146.115 \
  CONFIG.CLKOUT4_PHASE_ERROR 222.521 \
  CONFIG.CLKOUT4_REQUESTED_OUT_FREQ 150 \
  CONFIG.CLKOUT4_USED true \
  CONFIG.CLKOUT5_JITTER 164.861 \
  CONFIG.CLKOUT5_PHASE_ERROR 222.521 \
  CONFIG.CLKOUT5_REQUESTED_OUT_FREQ 50 \
  CONFIG.CLKOUT5_USED true \
  CONFIG.CLKOUT6_DRIVES Buffer \
  CONFIG.CLKOUT6_JITTER 135.994 \
  CONFIG.CLKOUT6_MATCHED_ROUTING true \
  CONFIG.CLKOUT6_PHASE_ERROR 222.521 \
  CONFIG.CLKOUT6_REQUESTED_OUT_FREQ 300 \
  CONFIG.CLKOUT6_USED true \
  CONFIG.CLKOUT7_DRIVES Buffer \
  CONFIG.CLKOUT7_JITTER 135.994 \
  CONFIG.CLKOUT7_MATCHED_ROUTING true \
  CONFIG.CLKOUT7_PHASE_ERROR 222.521 \
  CONFIG.CLKOUT7_REQUESTED_OUT_FREQ 300 \
  CONFIG.CLKOUT7_USED true \
  CONFIG.CLK_IN1_BOARD_INTERFACE som240_2_connector_hpb_clk0p_clk \
  CONFIG.CLK_IN2_BOARD_INTERFACE Custom \
  CONFIG.CLK_OUT1_PORT clk_out_250M \
  CONFIG.CLK_OUT2_PORT clk_out_100M \
  CONFIG.CLK_OUT3_PORT clk_out_125M \
  CONFIG.CLK_OUT4_PORT clk_out_150M \
  CONFIG.CLK_OUT5_PORT clk_out_50M \
  CONFIG.CLK_OUT6_PORT clk_out_300M \
  CONFIG.CLK_OUT7_PORT clk_out_300M_rp \
  CONFIG.ENABLE_CDDC false \
  CONFIG.FEEDBACK_SOURCE FDBK_AUTO \
  CONFIG.MMCM_CLKFBOUT_MULT_F 60.000 \
  CONFIG.MMCM_CLKIN1_PERIOD 40.000 \
  CONFIG.MMCM_CLKIN2_PERIOD 10.0 \
  CONFIG.MMCM_CLKOUT0_DIVIDE_F 6.000 \
  CONFIG.MMCM_CLKOUT1_DIVIDE 15 \
  CONFIG.MMCM_CLKOUT2_DIVIDE 12 \
  CONFIG.MMCM_CLKOUT3_DIVIDE 10 \
  CONFIG.MMCM_CLKOUT4_DIVIDE 30 \
  CONFIG.MMCM_CLKOUT5_DIVIDE 5 \
  CONFIG.MMCM_CLKOUT6_DIVIDE 5 \
  CONFIG.NUM_OUT_CLKS 7 \
  CONFIG.OPTIMIZE_CLOCKING_STRUCTURE_EN true \
  CONFIG.RESET_PORT resetn \
  CONFIG.RESET_TYPE ACTIVE_LOW \
  CONFIG.SECONDARY_IN_FREQ 100.000 \
  CONFIG.SECONDARY_SOURCE Single_ended_clock_capable_pin \
  CONFIG.USE_BOARD_FLOW true \
  CONFIG.USE_INCLK_SWITCHOVER false \
] [get_bd_cells clk_wiz_hpb]
create_bd_cell -type ip -vlnv xilinx.com:ip:proc_sys_reset:5.0 proc_sys_reset_1

# ---- connections ----

current_bd_instance /rgmii
connect_bd_intf_net [get_bd_intf_pins som240_1_connector_pl_gem2_rgmii_mdio_mdc] [get_bd_intf_pins gmii_to_rgmii_gem2/MDIO_PHY]
connect_bd_intf_net [get_bd_intf_pins som240_1_connector_pl_gem2_rgmii] [get_bd_intf_pins gmii_to_rgmii_gem2/RGMII]
connect_bd_intf_net [get_bd_intf_pins som240_2_connector_pl_gem3_rgmii_mdio_mdc] [get_bd_intf_pins gmii_to_rgmii_gem3/MDIO_PHY]
connect_bd_intf_net [get_bd_intf_pins som240_2_connector_pl_gem3_rgmii] [get_bd_intf_pins gmii_to_rgmii_gem3/RGMII]
connect_bd_intf_net -intf_net mpsoc_GMII_ENET2 [get_bd_intf_pins GMII] [get_bd_intf_pins gmii_to_rgmii_gem2/GMII]
connect_bd_intf_net -intf_net mpsoc_GMII_ENET3 [get_bd_intf_pins GMII1] [get_bd_intf_pins gmii_to_rgmii_gem3/GMII]
connect_bd_intf_net -intf_net mpsoc_MDIO_ENET3 [get_bd_intf_pins MDIO_GEM1] [get_bd_intf_pins gmii_to_rgmii_gem3/MDIO_GEM]
connect_bd_intf_net -intf_net mpsoc_MDIO_ENET4 [get_bd_intf_pins MDIO_GEM] [get_bd_intf_pins gmii_to_rgmii_gem2/MDIO_GEM]
connect_bd_net [get_bd_pins rx_reset] \
  [get_bd_pins gmii_to_rgmii_gem3/rx_reset] [get_bd_pins gmii_to_rgmii_gem3/tx_reset] \
  [get_bd_pins gmii_to_rgmii_gem2/rx_reset] [get_bd_pins gmii_to_rgmii_resets/reset] \
  [get_bd_pins gmii_to_rgmii_gem2/tx_reset]
connect_bd_net -net bufgce_div_2_5M_BUFGCE_O [get_bd_pins gmii_clk_2_5m_in] \
  [get_bd_pins gmii_to_rgmii_gem3/gmii_clk_2_5m_in] [get_bd_pins gmii_to_rgmii_gem2/gmii_clk_2_5m_in]
connect_bd_net -net clk_wiz_hpa_clk_out125M [get_bd_pins gmii_clk_125m_in] \
  [get_bd_pins gmii_to_rgmii_gem3/gmii_clk_125m_in] [get_bd_pins gmii_to_rgmii_gem2/gmii_clk_125m_in]
connect_bd_net -net clk_wiz_hpa_clk_out25M [get_bd_pins gmii_clk_25m_in] \
  [get_bd_pins gmii_to_rgmii_gem3/gmii_clk_25m_in] [get_bd_pins gmii_to_rgmii_gem2/gmii_clk_25m_in]
connect_bd_net -net clk_wiz_hpa_clk_out375M [get_bd_pins ref_clk] \
  [get_bd_pins gmii_to_rgmii_resets/ref_clk] [get_bd_pins util_idelay_ctrl_rgmii/ref_clk] \
  [get_bd_pins gmii_to_rgmii_gem3/ref_clk_in] [get_bd_pins gmii_to_rgmii_gem2/ref_clk_in]
connect_bd_net -net clk_wiz_hpa_locked [get_bd_pins mmcm_locked_in] \
  [get_bd_pins gmii_to_rgmii_gem3/mmcm_locked_in] [get_bd_pins gmii_to_rgmii_gem2/mmcm_locked_in]
connect_bd_net -net gmii_to_rgmii_0_rese_0_idelayctrl_reset [get_bd_pins gmii_to_rgmii_resets/idelayctrl_reset] \
  [get_bd_pins util_idelay_ctrl_rgmii/rst]

current_bd_instance /clk_reset_gen
connect_bd_net [get_bd_pins proc_sys_reset_375M/peripheral_reset] [get_bd_pins peripheral_reset]
connect_bd_net [get_bd_pins proc_sys_reset_rp/interconnect_aresetn] [get_bd_pins interconnect_aresetn1]
connect_bd_net [get_bd_pins slowest_sync_clk1] [get_bd_pins proc_sys_reset_1/slowest_sync_clk]
connect_bd_net [get_bd_pins proc_sys_reset_1/interconnect_aresetn] [get_bd_pins interconnect_aresetn3]
connect_bd_net [get_bd_pins bufgce_div_2_5M/BUFGCE_O] [get_bd_pins BUFGCE_O1]
connect_bd_net [get_bd_pins clk_wiz_4/clk_out1] [get_bd_pins slowest_sync_clk] [get_bd_pins proc_sys_reset_80M/slowest_sync_clk]
connect_bd_net [get_bd_pins clk_wiz_4/locked] [get_bd_pins proc_sys_reset_80M/dcm_locked]
connect_bd_net -net clk_wiz_clk_out_250M [get_bd_pins clk_wiz_hpb/clk_out_250M] [get_bd_pins clk_out_250M]
connect_bd_net [get_bd_pins clk_wiz_hpa/clk_out125M] [get_bd_pins clk_out125M]
connect_bd_net [get_bd_pins clk_wiz_hpa/clk_out20M_unbuf] [get_bd_pins bufgce_div_2_5M/BUFGCE_I]
connect_bd_net [get_bd_pins clk_wiz_hpa/clk_out25M] [get_bd_pins clk_out25M]
connect_bd_net [get_bd_pins clk_wiz_hpa/clk_out375M] [get_bd_pins clk_out375M] [get_bd_pins proc_sys_reset_375M/slowest_sync_clk]
connect_bd_net [get_bd_pins clk_wiz_hpa/locked] \
  [get_bd_pins locked] [get_bd_pins proc_sys_reset_375M/dcm_locked] [get_bd_pins bufgce_div_2_5M/BUFGCE_CE]
connect_bd_net [get_bd_pins clk_wiz_hpb/clk_out_100M] [get_bd_pins clk_wiz_4/clk_in1]
connect_bd_net [get_bd_pins clk_wiz_hpb/clk_out_300M] [get_bd_pins proc_sys_reset_fpd/slowest_sync_clk] [get_bd_pins clk_out_300M]
connect_bd_net [get_bd_pins clk_wiz_hpb/clk_out_300M_rp] [get_bd_pins proc_sys_reset_rp/slowest_sync_clk] [get_bd_pins clk_out_300M_rp]
connect_bd_net [get_bd_pins clk_wiz_hpb/locked] \
  [get_bd_pins proc_sys_reset_rp/dcm_locked] [get_bd_pins locked1] [get_bd_pins proc_sys_reset_fpd/dcm_locked]
connect_bd_net -net ext_reset_in1_1 [get_bd_pins ext_reset_in1] [get_bd_pins proc_sys_reset_rp/ext_reset_in]
connect_bd_net [get_bd_pins ilconstant_zero/dout] [get_bd_pins bufgce_div_2_5M/BUFGCE_CLR]
connect_bd_net -net mpsoc_pl_resetn1 [get_bd_pins resetn1] [get_bd_pins clk_wiz_hpa/resetn] [get_bd_pins proc_sys_reset_375M/ext_reset_in]
connect_bd_net -net proc_sys_reset_0_interconnect_aresetn [get_bd_pins proc_sys_reset_80M/interconnect_aresetn] [get_bd_pins interconnect_aresetn2]
connect_bd_net [get_bd_pins proc_sys_reset_1/peripheral_aresetn] [get_bd_pins peripheral_aresetn]
connect_bd_net [get_bd_pins proc_sys_reset_fpd/interconnect_aresetn] [get_bd_pins interconnect_aresetn]
connect_bd_net [get_bd_pins proc_sys_reset_fpd/peripheral_aresetn] [get_bd_pins peripheral_aresetn1]
connect_bd_net [get_bd_pins som240_1_connector_hpa_clk0p_clk] [get_bd_pins clk_wiz_hpa/clk_in1]
connect_bd_net [get_bd_pins som240_2_connector_hpb_clk0p_clk] [get_bd_pins clk_wiz_hpb/clk_in1]
connect_bd_net -net zynq_ultra_ps_e_0_pl_resetn0 [get_bd_pins resetn] \
  [get_bd_pins clk_wiz_hpb/resetn] [get_bd_pins clk_wiz_4/resetn] [get_bd_pins proc_sys_reset_80M/ext_reset_in] \
  [get_bd_pins proc_sys_reset_1/ext_reset_in] [get_bd_pins proc_sys_reset_fpd/ext_reset_in]

current_bd_instance /
connect_bd_intf_net [get_bd_intf_pins VitisRegion/S_AXI_CTRL] [get_bd_intf_pins dfx_decoupler_0/rp_s_axi_ctrl]
connect_bd_intf_net -intf_net S_BSCAN_0_1 [get_bd_intf_pins VitisRegion/S_BSCAN_0] [get_bd_intf_pins debug_bridge_0/m0_bscan]
connect_bd_intf_net -intf_net VitisRegion_0_M_AXI_GMEM [get_bd_intf_pins VitisRegion/M_AXI_GMEM] [get_bd_intf_pins dfx_decoupler_0/rp_axi_data]
connect_bd_intf_net -intf_net VitisRegion_0_M_AXI_GMEM1 [get_bd_intf_pins VitisRegion/M_AXI_GMEM1] [get_bd_intf_pins dfx_decoupler_0/rp_axi_data1]
connect_bd_intf_net -intf_net VitisRegion_0_M_AXI_GMEM2 [get_bd_intf_pins VitisRegion/M_AXI_GMEM2] [get_bd_intf_pins dfx_decoupler_0/rp_axi_data2]
connect_bd_intf_net [get_bd_intf_pins axi_clock_converter_1/M_AXI] [get_bd_intf_pins smartconnect_hp0/S00_AXI]
connect_bd_intf_net [get_bd_intf_pins smartconnect_hpc0/S00_AXI] [get_bd_intf_pins axi_clock_converter_2/M_AXI]
connect_bd_intf_net [get_bd_intf_pins dfx_decoupler_0/s_s_axi_ctrl] [get_bd_intf_pins axi_clock_converter_3/M_AXI]
connect_bd_intf_net [get_bd_intf_pins smartconnect_hpc1/S00_AXI] [get_bd_intf_pins axi_clock_converter_4/M_AXI]
connect_bd_intf_net [get_bd_intf_pins debug_bridge_1/S_BSCAN] [get_bd_intf_pins debug_bridge_0/m1_bscan]
connect_bd_intf_net [get_bd_intf_pins dfx_decoupler_0/s_axi_data] [get_bd_intf_pins axi_clock_converter_1/S_AXI]
connect_bd_intf_net [get_bd_intf_pins axi_clock_converter_2/S_AXI] [get_bd_intf_pins dfx_decoupler_0/s_axi_data1]
connect_bd_intf_net [get_bd_intf_pins axi_clock_converter_4/S_AXI] [get_bd_intf_pins dfx_decoupler_0/s_axi_data2]
connect_bd_intf_net [get_bd_intf_ports som240_1_connector_pl_gem2_rgmii_mdio_mdc] [get_bd_intf_pins rgmii/som240_1_connector_pl_gem2_rgmii_mdio_mdc]
connect_bd_intf_net [get_bd_intf_ports som240_1_connector_pl_gem2_rgmii] [get_bd_intf_pins rgmii/som240_1_connector_pl_gem2_rgmii]
connect_bd_intf_net [get_bd_intf_ports som240_2_connector_pl_gem3_rgmii_mdio_mdc] [get_bd_intf_pins rgmii/som240_2_connector_pl_gem3_rgmii_mdio_mdc]
connect_bd_intf_net [get_bd_intf_ports som240_2_connector_pl_gem3_rgmii] [get_bd_intf_pins rgmii/som240_2_connector_pl_gem3_rgmii]
connect_bd_intf_net -intf_net mpsoc_GMII_ENET2 [get_bd_intf_pins rgmii/GMII] [get_bd_intf_pins zynq_ultra_ps_e_0/GMII_ENET2]
connect_bd_intf_net -intf_net mpsoc_GMII_ENET3 [get_bd_intf_pins rgmii/GMII1] [get_bd_intf_pins zynq_ultra_ps_e_0/GMII_ENET3]
connect_bd_intf_net -intf_net mpsoc_MDIO_ENET3 [get_bd_intf_pins rgmii/MDIO_GEM1] [get_bd_intf_pins zynq_ultra_ps_e_0/MDIO_ENET3]
connect_bd_intf_net -intf_net mpsoc_MDIO_ENET4 [get_bd_intf_pins rgmii/MDIO_GEM] [get_bd_intf_pins zynq_ultra_ps_e_0/MDIO_ENET2]
connect_bd_intf_net -intf_net smartconnect_0_M00_AXI [get_bd_intf_pins smartconnect_hpm0_fpd/M00_AXI] [get_bd_intf_pins vcu_0/S_AXI_LITE]
connect_bd_intf_net [get_bd_intf_pins zynq_ultra_ps_e_0/S_AXI_HP0_FPD] [get_bd_intf_pins smartconnect_hp0/M00_AXI]
connect_bd_intf_net [get_bd_intf_pins smartconnect_hpc0/M00_AXI] [get_bd_intf_pins zynq_ultra_ps_e_0/S_AXI_HPC0_FPD]
connect_bd_intf_net [get_bd_intf_pins smartconnect_hpc1/M00_AXI] [get_bd_intf_pins zynq_ultra_ps_e_0/S_AXI_HPC1_FPD]
connect_bd_intf_net [get_bd_intf_pins smartconnect_hpm1_fpd/M00_AXI] [get_bd_intf_pins dfx_decoupler_0/s_axi_reg]
connect_bd_intf_net [get_bd_intf_pins smartconnect_hpm1_fpd/M01_AXI] [get_bd_intf_pins axi_clock_converter_3/S_AXI]
connect_bd_intf_net [get_bd_intf_pins smartconnect_vcu_enc1/M00_AXI] [get_bd_intf_pins zynq_ultra_ps_e_0/S_AXI_HP2_FPD]
connect_bd_intf_net [get_bd_intf_pins smartconnect_vcu_enc/M00_AXI] [get_bd_intf_pins zynq_ultra_ps_e_0/S_AXI_HP1_FPD]
connect_bd_intf_net [get_bd_intf_pins vcu_0/M_AXI_DEC0] [get_bd_intf_pins smartconnect_vcu_enc1/S00_AXI]
connect_bd_intf_net [get_bd_intf_pins vcu_0/M_AXI_DEC1] [get_bd_intf_pins smartconnect_vcu_enc1/S01_AXI]
connect_bd_intf_net [get_bd_intf_pins vcu_0/M_AXI_ENC0] [get_bd_intf_pins smartconnect_vcu_enc/S00_AXI]
connect_bd_intf_net [get_bd_intf_pins vcu_0/M_AXI_ENC1] [get_bd_intf_pins smartconnect_vcu_enc/S01_AXI]
connect_bd_intf_net [get_bd_intf_pins vcu_0/M_AXI_MCU] [get_bd_intf_pins zynq_ultra_ps_e_0/S_AXI_HP3_FPD]
connect_bd_intf_net [get_bd_intf_pins smartconnect_hpm0_fpd/S00_AXI] [get_bd_intf_pins zynq_ultra_ps_e_0/M_AXI_HPM0_FPD]
connect_bd_intf_net [get_bd_intf_pins smartconnect_hpm1_fpd/S00_AXI] [get_bd_intf_pins zynq_ultra_ps_e_0/M_AXI_HPM1_FPD]
connect_bd_net [get_bd_pins clk_reset_gen/peripheral_reset] [get_bd_pins rgmii/rx_reset]
connect_bd_net [get_bd_pins clk_reset_gen/interconnect_aresetn1] \
  [get_bd_pins dfx_decoupler_0/s_resetn_RST] [get_bd_pins dfx_decoupler_0/axi_data_arstn] \
  [get_bd_pins axi_clock_converter_1/s_axi_aresetn] [get_bd_pins axi_clock_converter_3/m_axi_aresetn] \
  [get_bd_pins dfx_decoupler_0/s_axi_ctrl_arstn] [get_bd_pins axi_clock_converter_4/s_axi_aresetn] \
  [get_bd_pins axi_clock_converter_2/s_axi_aresetn] [get_bd_pins dfx_decoupler_0/axi_data1_arstn] \
  [get_bd_pins dfx_decoupler_0/axi_data2_arstn]
connect_bd_net [get_bd_pins zynq_ultra_ps_e_0/pl_clk3] \
  [get_bd_pins vcu_0/pll_ref_clk] [get_bd_pins vcu_0/s_axi_lite_aclk] [get_bd_pins smartconnect_hpm0_fpd/aclk] \
  [get_bd_pins proc_sys_reset_0/slowest_sync_clk] [get_bd_pins zynq_ultra_ps_e_0/maxihpm0_fpd_aclk]
connect_bd_net [get_bd_pins zynq_ultra_ps_e_0/pl_clk2] \
  [get_bd_pins vcu_0/m_axi_dec_aclk] [get_bd_pins vcu_0/m_axi_enc_aclk] [get_bd_pins vcu_0/m_axi_mcu_aclk] \
  [get_bd_pins smartconnect_vcu_enc/aclk] [get_bd_pins smartconnect_vcu_enc1/aclk] \
  [get_bd_pins zynq_ultra_ps_e_0/saxihp1_fpd_aclk] [get_bd_pins zynq_ultra_ps_e_0/saxihp2_fpd_aclk] \
  [get_bd_pins zynq_ultra_ps_e_0/saxihp3_fpd_aclk] [get_bd_pins clk_reset_gen/slowest_sync_clk1]
connect_bd_net [get_bd_pins clk_reset_gen/interconnect_aresetn3] \
  [get_bd_pins smartconnect_vcu_enc/aresetn] [get_bd_pins smartconnect_vcu_enc1/aresetn]
connect_bd_net -net VitisRegion_0_interrupt [get_bd_pins VitisRegion/interrupt] [get_bd_pins dfx_decoupler_0/rp_interrupt_INTERRUPT]
connect_bd_net -net VitisRegion_0_sfp_led [get_bd_pins VitisRegion/sfp_led] [get_bd_pins dfx_decoupler_0/rp_sfp_led_DATA]
connect_bd_net -net VitisRegion_0_user_led [get_bd_pins VitisRegion/user_led] [get_bd_pins dfx_decoupler_0/rp_user_led_DATA]
connect_bd_net -net bufgce_div_2_5M_BUFGCE_O [get_bd_pins clk_reset_gen/BUFGCE_O1] [get_bd_pins rgmii/gmii_clk_2_5m_in]
connect_bd_net [get_bd_pins clk_reset_gen/locked1] [get_bd_pins ilconcat_0/In5]
connect_bd_net [get_bd_pins clk_reset_gen/peripheral_aresetn1] [get_bd_pins dfx_decoupler_0/s_axi_reg_aresetn]
connect_bd_net -net clk_wiz_clk_out_250M [get_bd_pins clk_reset_gen/clk_out_250M] [get_bd_pins zynq_ultra_ps_e_0/emio_enet_tsu_clk]
connect_bd_net -net clk_wiz_hpa_clk_out125M [get_bd_pins clk_reset_gen/clk_out125M] [get_bd_pins rgmii/gmii_clk_125m_in]
connect_bd_net -net clk_wiz_hpa_clk_out25M [get_bd_pins clk_reset_gen/clk_out25M] [get_bd_pins rgmii/gmii_clk_25m_in]
connect_bd_net -net clk_wiz_hpa_clk_out375M [get_bd_pins clk_reset_gen/clk_out375M] [get_bd_pins rgmii/ref_clk]
connect_bd_net -net clk_wiz_hpa_locked [get_bd_pins clk_reset_gen/locked] [get_bd_pins rgmii/mmcm_locked_in]
connect_bd_net -net clk_wiz_hpb_clk_out_300M_rp [get_bd_pins clk_reset_gen/clk_out_300M_rp] \
  [get_bd_pins dfx_decoupler_0/axi_data_aclk] [get_bd_pins axi_clock_converter_1/s_axi_aclk] \
  [get_bd_pins axi_clock_converter_3/m_axi_aclk] [get_bd_pins dfx_decoupler_0/s_axi_ctrl_aclk] \
  [get_bd_pins axi_clock_converter_2/s_axi_aclk] [get_bd_pins axi_clock_converter_4/s_axi_aclk] \
  [get_bd_pins dfx_decoupler_0/axi_data1_aclk] [get_bd_pins dfx_decoupler_0/axi_data2_aclk] \
  [get_bd_pins VitisRegion/ref_clk_300M]
connect_bd_net [get_bd_pins dfx_decoupler_0/decouple_status] [get_bd_pins ilconcat_1/In0]
connect_bd_net [get_bd_pins dfx_decoupler_0/s_interrupt_INTERRUPT] [get_bd_pins zynq_ultra_ps_e_0/pl_ps_irq0]
connect_bd_net [get_bd_pins dfx_decoupler_0/s_user_led_DATA] [get_bd_ports som240_1_connector_User_led_tri_o]
connect_bd_net -net ext_reset_1 [get_bd_pins dfx_decoupler_0/rp_resetn_RST] [get_bd_pins VitisRegion/ext_reset]
connect_bd_net -net ext_resetn_80M_1 [get_bd_pins dfx_decoupler_0/rp_resetn_80M_RST] [get_bd_pins VitisRegion/ext_resetn_80M]
connect_bd_net [get_bd_pins ilconcat_0/dout] [get_bd_pins zynq_ultra_ps_e_0/emio_gpio_i]
connect_bd_net [get_bd_pins ilconcat_1/dout] [get_bd_ports som240_1_connector_sfp_led]
connect_bd_net [get_bd_pins ilconstant_three/dout] \
  [get_bd_pins zynq_ultra_ps_e_0/emio_enet2_tsu_inc_ctrl] [get_bd_pins zynq_ultra_ps_e_0/emio_enet3_tsu_inc_ctrl]
connect_bd_net [get_bd_pins ilslice_0/Dout] [get_bd_ports fan_en_b]
connect_bd_net -net ilslice_0_Dout_1 [get_bd_pins zynq_ultra_ps_e_0/emio_gpio_o] \
  [get_bd_pins ilslice_gem2_reset/Din] [get_bd_pins ilslice_gem3_reset/Din] [get_bd_pins ilslice_vcu_resetn/Din]
connect_bd_net [get_bd_pins ilslice_vcu_resetn/Dout] [get_bd_pins vcu_0/vcu_resetn]
connect_bd_net -net mpsoc_emio_ttc0_wave_o [get_bd_pins zynq_ultra_ps_e_0/emio_ttc0_wave_o] [get_bd_pins ilslice_0/Din]
connect_bd_net -net mpsoc_pl_resetn1 [get_bd_pins zynq_ultra_ps_e_0/pl_resetn1] [get_bd_pins clk_reset_gen/resetn1]
connect_bd_net -net mpsoc_som240_1_connector_pl_gem2_reset [get_bd_pins ilslice_gem2_reset/Dout] [get_bd_ports som240_1_connector_pl_gem2_reset]
connect_bd_net -net mpsoc_som240_2_connector_pl_gem3_reset [get_bd_pins ilslice_gem3_reset/Dout] [get_bd_ports som240_2_connector_pl_gem3_reset]
connect_bd_net -net proc_sys_reset_0_interconnect_aresetn [get_bd_pins clk_reset_gen/interconnect_aresetn2] \
  [get_bd_pins dfx_decoupler_0/s_resetn_80M_RST]
connect_bd_net [get_bd_pins proc_sys_reset_0/interconnect_aresetn] [get_bd_pins smartconnect_hpm0_fpd/aresetn]
connect_bd_net -net proc_sys_reset_fpd_interconnect_aresetn [get_bd_pins clk_reset_gen/interconnect_aresetn] \
  [get_bd_pins axi_clock_converter_1/m_axi_aresetn] [get_bd_pins smartconnect_hp0/aresetn] \
  [get_bd_pins axi_clock_converter_3/s_axi_aresetn] [get_bd_pins smartconnect_hpm1_fpd/aresetn] \
  [get_bd_pins axi_clock_converter_4/m_axi_aresetn] [get_bd_pins axi_clock_converter_2/m_axi_aresetn] \
  [get_bd_pins smartconnect_hpc0/aresetn] [get_bd_pins smartconnect_hpc1/aresetn]
connect_bd_net -net ref_clk_80M_1 [get_bd_pins clk_reset_gen/slowest_sync_clk] [get_bd_pins VitisRegion/ref_clk_80M]
connect_bd_net [get_bd_ports som240_1_connector_hpa_clk0p_clk] [get_bd_pins clk_reset_gen/som240_1_connector_hpa_clk0p_clk]
connect_bd_net [get_bd_ports som240_2_connector_hpb_clk0p_clk] [get_bd_pins clk_reset_gen/som240_2_connector_hpb_clk0p_clk]
connect_bd_net [get_bd_pins vcu_0/vcu_host_interrupt] [get_bd_pins zynq_ultra_ps_e_0/pl_ps_irq1]
connect_bd_net [get_bd_pins zynq_ultra_ps_e_0/fmio_gem_tsu_clk_to_pl_bufg] [get_bd_pins zynq_ultra_ps_e_0/fmio_gem_tsu_clk_from_pl]
connect_bd_net -net zynq_ultra_ps_e_0_pl_clk1 [get_bd_pins clk_reset_gen/clk_out_300M] \
  [get_bd_pins axi_clock_converter_1/m_axi_aclk] [get_bd_pins smartconnect_hp0/aclk] \
  [get_bd_pins axi_clock_converter_3/s_axi_aclk] [get_bd_pins debug_bridge_1/clk] [get_bd_pins dfx_decoupler_0/aclk] \
  [get_bd_pins smartconnect_hpm1_fpd/aclk] [get_bd_pins zynq_ultra_ps_e_0/maxihpm1_fpd_aclk] \
  [get_bd_pins zynq_ultra_ps_e_0/saxihp0_fpd_aclk] [get_bd_pins axi_clock_converter_4/m_axi_aclk] \
  [get_bd_pins axi_clock_converter_2/m_axi_aclk] [get_bd_pins smartconnect_hpc0/aclk] [get_bd_pins smartconnect_hpc1/aclk] \
  [get_bd_pins zynq_ultra_ps_e_0/saxihpc1_fpd_aclk] [get_bd_pins zynq_ultra_ps_e_0/saxihpc0_fpd_aclk]
